# Altium project MICROCONTROLLER.PrjPcb
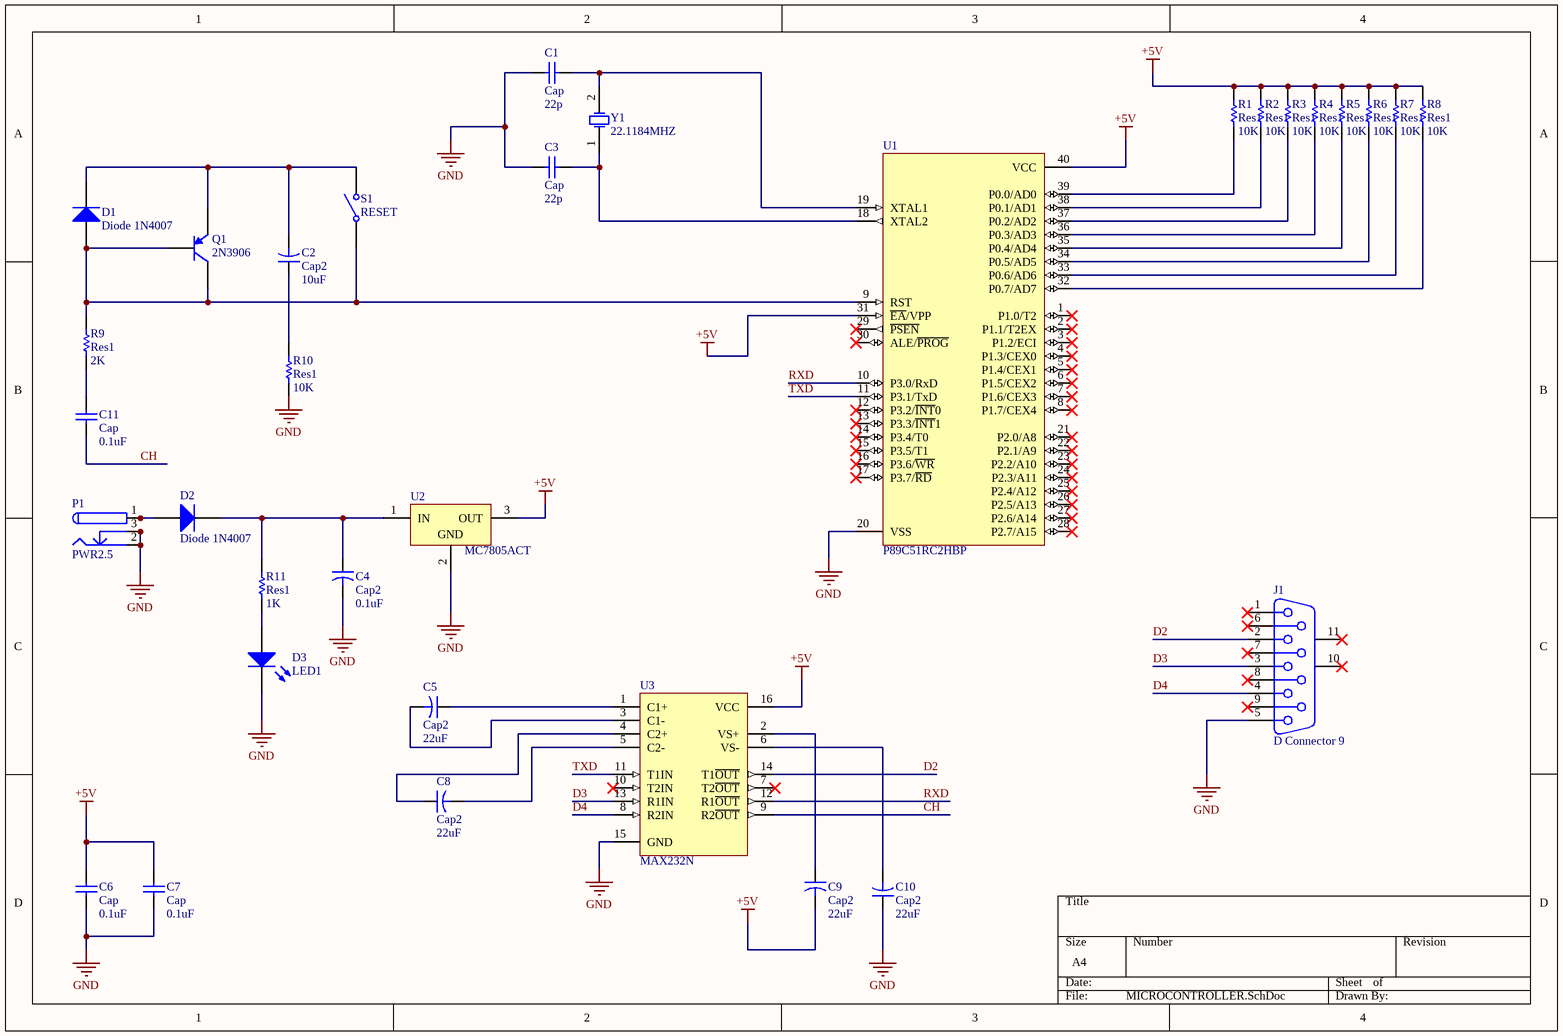
[diagram p0: MICROCONTROLLER.SchDoc]
1 sheet, 33 parts. Net scope: global (net labels, ports and power ports of the same name join across sheets).
Board file: MICROCONTROLLER_02.PcbDoc

## Sheet MICROCONTROLLER.SchDoc
size A4

### Parts
C1  Cap  value 22p  [CAPR2.54-5.1x3.2]
C2  Cap2  value 10uF  [CAPR5-4X5]
C3  Cap  value 22p  [CAPR2.54-5.1x3.2]
C4  Cap2  value 0.1uF  [CAPR5-4X5]
C5  Cap2  value 22uF  [CAPR5-4X5]
C6  Cap  value 0.1uF  [CAPR2.54-5.1x3.2]
C7  Cap  value 0.1uF  [CAPR2.54-5.1x3.2]
C8  Cap2  value 22uF  [CAPR5-4X5]
C9  Cap2  value 22uF  [CAPR5-4X5]
C10  Cap2  value 22uF  [CAPR5-4X5]
C11  Cap  value 0.1uF  [CAPR2.54-5.1x3.2]
D1  Diode 1N4007  [DIO10.46-5.3x2.8]
D2  Diode 1N4007  [DIO10.46-5.3x2.8]
D3  LED1  [LED-1]
J1  D Connector 9  [DSUB1.385-2H9]
P1  PWR2.5  [KLD-0202]
Q1  2N3906  [BCY-W3/E4]
R1  Res1  value 10K  [AXIAL-0.3]
R2  Res1  value 10K  [AXIAL-0.3]
R3  Res1  value 10K  [AXIAL-0.3]
R4  Res1  value 10K  [AXIAL-0.3]
R5  Res1  value 10K  [AXIAL-0.3]
R6  Res1  value 10K  [AXIAL-0.3]
R7  Res1  value 10K  [AXIAL-0.3]
R8  Res1  value 10K  [AXIAL-0.3]
R9  Res1  value 2K  [AXIAL-0.3]
R10  Res1  value 10K  [AXIAL-0.3]
R11  Res1  value 1K  [AXIAL-0.3]
S1  RESET  [SPST-2]
U1  P89C51RC2HBP  [SOT129-1]
U2  MC7805ACT  [221A-04]
U3  MAX232N  [N016]
Y1  22.1184MHZ  [HC-49U]

### Nets
+5V: C6.2 C7.1 C9.2 R1.2 R2.2 R3.2 R4.2 R5.2 R6.2 R7.2 R8.2 U1.31(~{EA}/VPP) U1.40(VCC) U2.3(OUT) U3.16(VCC)
GND: C1.2 C3.2 C4.2 C6.1 C7.2 C10.1 D3.2(K) J1.5 P1.2 P1.2A P1.2B P1.3 P1.3A P1.3B R10.1 U1.20(VSS) U2.2(GND) U3.15(GND)
CH: C11.1 U3.9(R2~{OUT})
D2: J1.2 U3.14(T1~{OUT})
D3: J1.3 U3.13(R1IN)
D4: J1.4 U3.8(R2IN)
RXD: U1.10(P3.0/RxD) U3.12(R1~{OUT})
TXD: U1.11(P3.1/TxD) U3.11(T1IN)
NetC1_1: C1.1 U1.19(XTAL1) Y1.2(OSC2)
NetC2_1: C2.1 R10.2
NetC2_2: C2.2 D1.2(K) Q1.1(E) S1.2(NO)
NetC3_1: C3.1 U1.18(XTAL2) Y1.1(OSC1)
NetC4_1: C4.1 D2.2(K) R11.2 U2.1(IN)
NetC5_1: C5.1 U3.1(C1+)
NetC5_2: C5.2 U3.3(C1-)
NetC8_1: C8.1 U3.4(C2+)
NetC8_2: C8.2 U3.5(C2-)
NetC9_1: C9.1 U3.2(VS+)
NetC10_2: C10.2 U3.6(VS-)
NetC11_2: C11.2 R9.1
NetD1_1: D1.1(A) Q1.2(B) Q1.3(C) R9.2 S1.1(COMMON) U1.9(RST)
NetD2_1: D2.1(A) P1.1 P1.1A P1.1B
NetD3_1: D3.1(A) R11.1
NetR1_1: R1.1 U1.39(P0.0/AD0)
NetR2_1: R2.1 U1.38(P0.1/AD1)
NetR3_1: R3.1 U1.37(P0.2/AD2)
NetR4_1: R4.1 U1.36(P0.3/AD3)
NetR5_1: R5.1 U1.35(P0.4/AD4)
NetR6_1: R6.1 U1.34(P0.5/AD5)
NetR7_1: R7.1 U1.33(P0.6/AD6)
NetR8_1: R8.1 U1.32(P0.7/AD7)

Not connected (* = marked no-connect by the designer): J1 1* 6* 7* 8* 9* 10(MH1)* 11(MH2)*; U1 1(P1.0/T2)* 2(P1.1/T2EX)* 3(P1.2/ECI)* 4(P1.3/CEX0)* 5(P1.4/CEX1)* 6(P1.5/CEX2)* 7(P1.6/CEX3)* 8(P1.7/CEX4)* 12(P3.2/~{INT}0)* 13(P3.3/~{INT}1)* 14(P3.4/T0)* 15(P3.5/T1)* 16(P3.6/~{WR})* 17(P3.7/~{RD})* 21(P2.0/A8)* 22(P2.1/A9)* 23(P2.2/A10)* 24(P2.3/A11)* 25(P2.4/A12)* 26(P2.5/A13)* 27(P2.6/A14)* 28(P2.7/A15)* 29(~{PSEN})* 30(ALE/~{PROG})*; U3 7(T2~{OUT})* 10(T2IN)*

### Library data of the parts
C1 C3 C6 C7 C11 = Cap: Capacitor; Published: 8-Jun-2000; LatestRevisionDate: 17-Jul-2002; LatestRevisionNote: Re-released for DXP Platform.; PackageReference: RAD-0.3; Publisher: Altium Limited
C2 C4 C5 C8-C10 = Cap2: Capacitor; Published: 23-Sep-2002; PackageReference: CAPR5-4X5; Publisher: Altium Limited
D1 D2 = Diode 1N4007: 1 Amp General Purpose Rectifier; Published: 8-Jun-2000; LatestRevisionDate: 17-Jul-2002; LatestRevisionNote: Re-released for DXP Platform.; DatasheetVersion: 1998; PackageVersion: Aug-1999; PackageReference: DO-41; Publisher: Altium Limited; Code_JEDEC: DO-204-AL; ComponentLink1Description: Manufacturer Link; ComponentLink1URL: http://www.fairchildsemi.com/; ComponentLink2Description: Datasheet; ComponentLink2URL: http://www.fairchildsemi.com/ds/1N%2F1N4001.pdf
D3 = LED1: Typical RED GaAs LED; Published: 8-Jun-2000; LatestRevisionDate: 08-Jul-2005; LatestRevisionNote: Mech Layer 1 removed.; PackageReference: LED-1; Publisher: Altium Limited
J1 = D Connector 9: Receptacle Assembly, 9 Position, Right Angle; PackageDocument: O; Positions: 9; Published: 15-Jun-2001; LatestRevisionDate: 17-Jul-2002; LatestRevisionNote: Re-released for DXP Platform.; DatasheetDocument: 1-Sep-1999; PackageReference: 788750; Publisher: Altium Limited; Orientation: Right Angle; Gender: Receptacle
P1 = PWR2.5: Low Voltage Power Supply Connector; Published: 17-Dec-2003; DatasheetDocument: 09-May-2002; Publisher: Altium Limited; ComponentLink1Description: Manufacturer Link; ComponentLink1URL: http://domino.kycon.com/internet/Products.html
Q1 = 2N3906: PNP General Purpose Amplifier; Published: 8-Jun-2000; LatestRevisionDate: 15-Jan-2003; LatestRevisionNote: PCB Footprint 'BCY-W3/D4.7' replaced; DatasheetVersion: 1997; PackageVersion: Sep-1998; PackageReference: TO-92A; Publisher: Altium Limited; Code_JEDEC: TO-92A; ComponentLink1Description: Manufacturer Link; ComponentLink1URL: http://www.fairchildsemi.com/; ComponentLink2Description: Datasheet; ComponentLink2URL: http://www.fairchildsemi.com/ds/2N%2F2N3906.pdf
R1-R11 = Res1: Resistor; Published: 8-Jun-2000; LatestRevisionDate: 17-Jul-2002; LatestRevisionNote: Re-released for DXP Platform.; PackageReference: AXIAL-0.3; Publisher: Altium Limited
S1 = SW-SPST: Single-Pole, Single-Throw Switch; Published: 24-Mar-1999; LatestRevisionDate: 17-Jul-2002; LatestRevisionNote: Re-released for DXP Platform.; PackageReference: SPST-2; Publisher: Altium Limited
U1 = P89C51RC2HBP: 80C51 8-Bit Flash Microcontroller Family, 32 kB ISP/IAP Flash with 512 B RAM.; Published: 21-May-2003; DatasheetVersion: 24-May-2002; PackageVersion: Aug-2000; PackageReference: SOT129-1; Publisher: Altium Limited; PackageDescription: DIP, Plastic; 40 Leads; Row Spacing 15.24 mm; Pitch 2.54 mm; Code_JEDEC: MO-015; ComponentLink1Description: Manufacturer Link; ComponentLink1URL: http://www-us2.semiconductors.philips.com/; ComponentLink2Description: Datasheet; ComponentLink2URL: http://www.semiconductors.philips.com/pip/P89C51RB2_RC2_RD2_9.html; ComponentLink3Description: Discontinuation Notice; ComponentLink3URL: http://www.semiconductors.philips.com/pip/old/P89C51RB2_RC2_RD2_9.html
U2 = MC7805ACT: 3-Terminal Positive Fixed Voltage Regulator; Note: Pin 2 is electrically connected to TAB; Published: 17-Jul-2002; DatasheetVersion: 1988; PackageReference: 221A-04; Publisher: Altium Limited; PackageDescription: TO, Thru-Hole, Vertical, Heatsink Mounted; 3 In-Line Leads; Pitch 2.54 mm; Code_JEDEC: TO-262-AA; ComponentLink1Description: Manufacturer Link; ComponentLink1URL: http://www.onsemi.com/site/products/taxonomy/0,4438,503,00.html; ComponentLink2Description: Datasheet; ComponentLink2URL: http://www.onsemi.com/pub/Collateral/MC7800-D.PDF
U3 = MAX232N: Dual EIA-232 Driver/Receiver; Note: Receivers have typical hysteresis of 0.5V; Published: 15-May-2002; LatestRevisionDate: 04-Mar-2005; LatestRevisionNote: Stylized 3D Model Added.; DatasheetVersion: Jun-1989; PackageVersion: Oct-1995; PackageReference: N016; Publisher: Altium Limited; PackageDescription: DIP; 16 Leads; Row Spacing 7.62 mm; Pitch 2.54 mm; Code_JEDEC: MS-001-BB; ComponentLink1Description: Manufacturer Link; ComponentLink1URL: http://www.ti.com/; ComponentLink2Description: Datasheet; ComponentLink2URL: http://www-s.ti.com/sc/ds/max232.pdf
Y1 = ECS-18-13-1: Crystal Oscillator; Published: 17-Jul-2002; DatasheetDocument: 18-Apr-2000; PackageReference: HC-49U; Publisher: Altium Limited; ComponentLink1Description: Manufacturer Link; ComponentLink1URL: http://www.ecsxtal.com/; ComponentLink2Description: Datasheet; ComponentLink2URL: http://www.ecsxtal.com/pdf2/HC49U.PDF